# EAGLE design PATA Breakout (EAGLE 9.2.2)
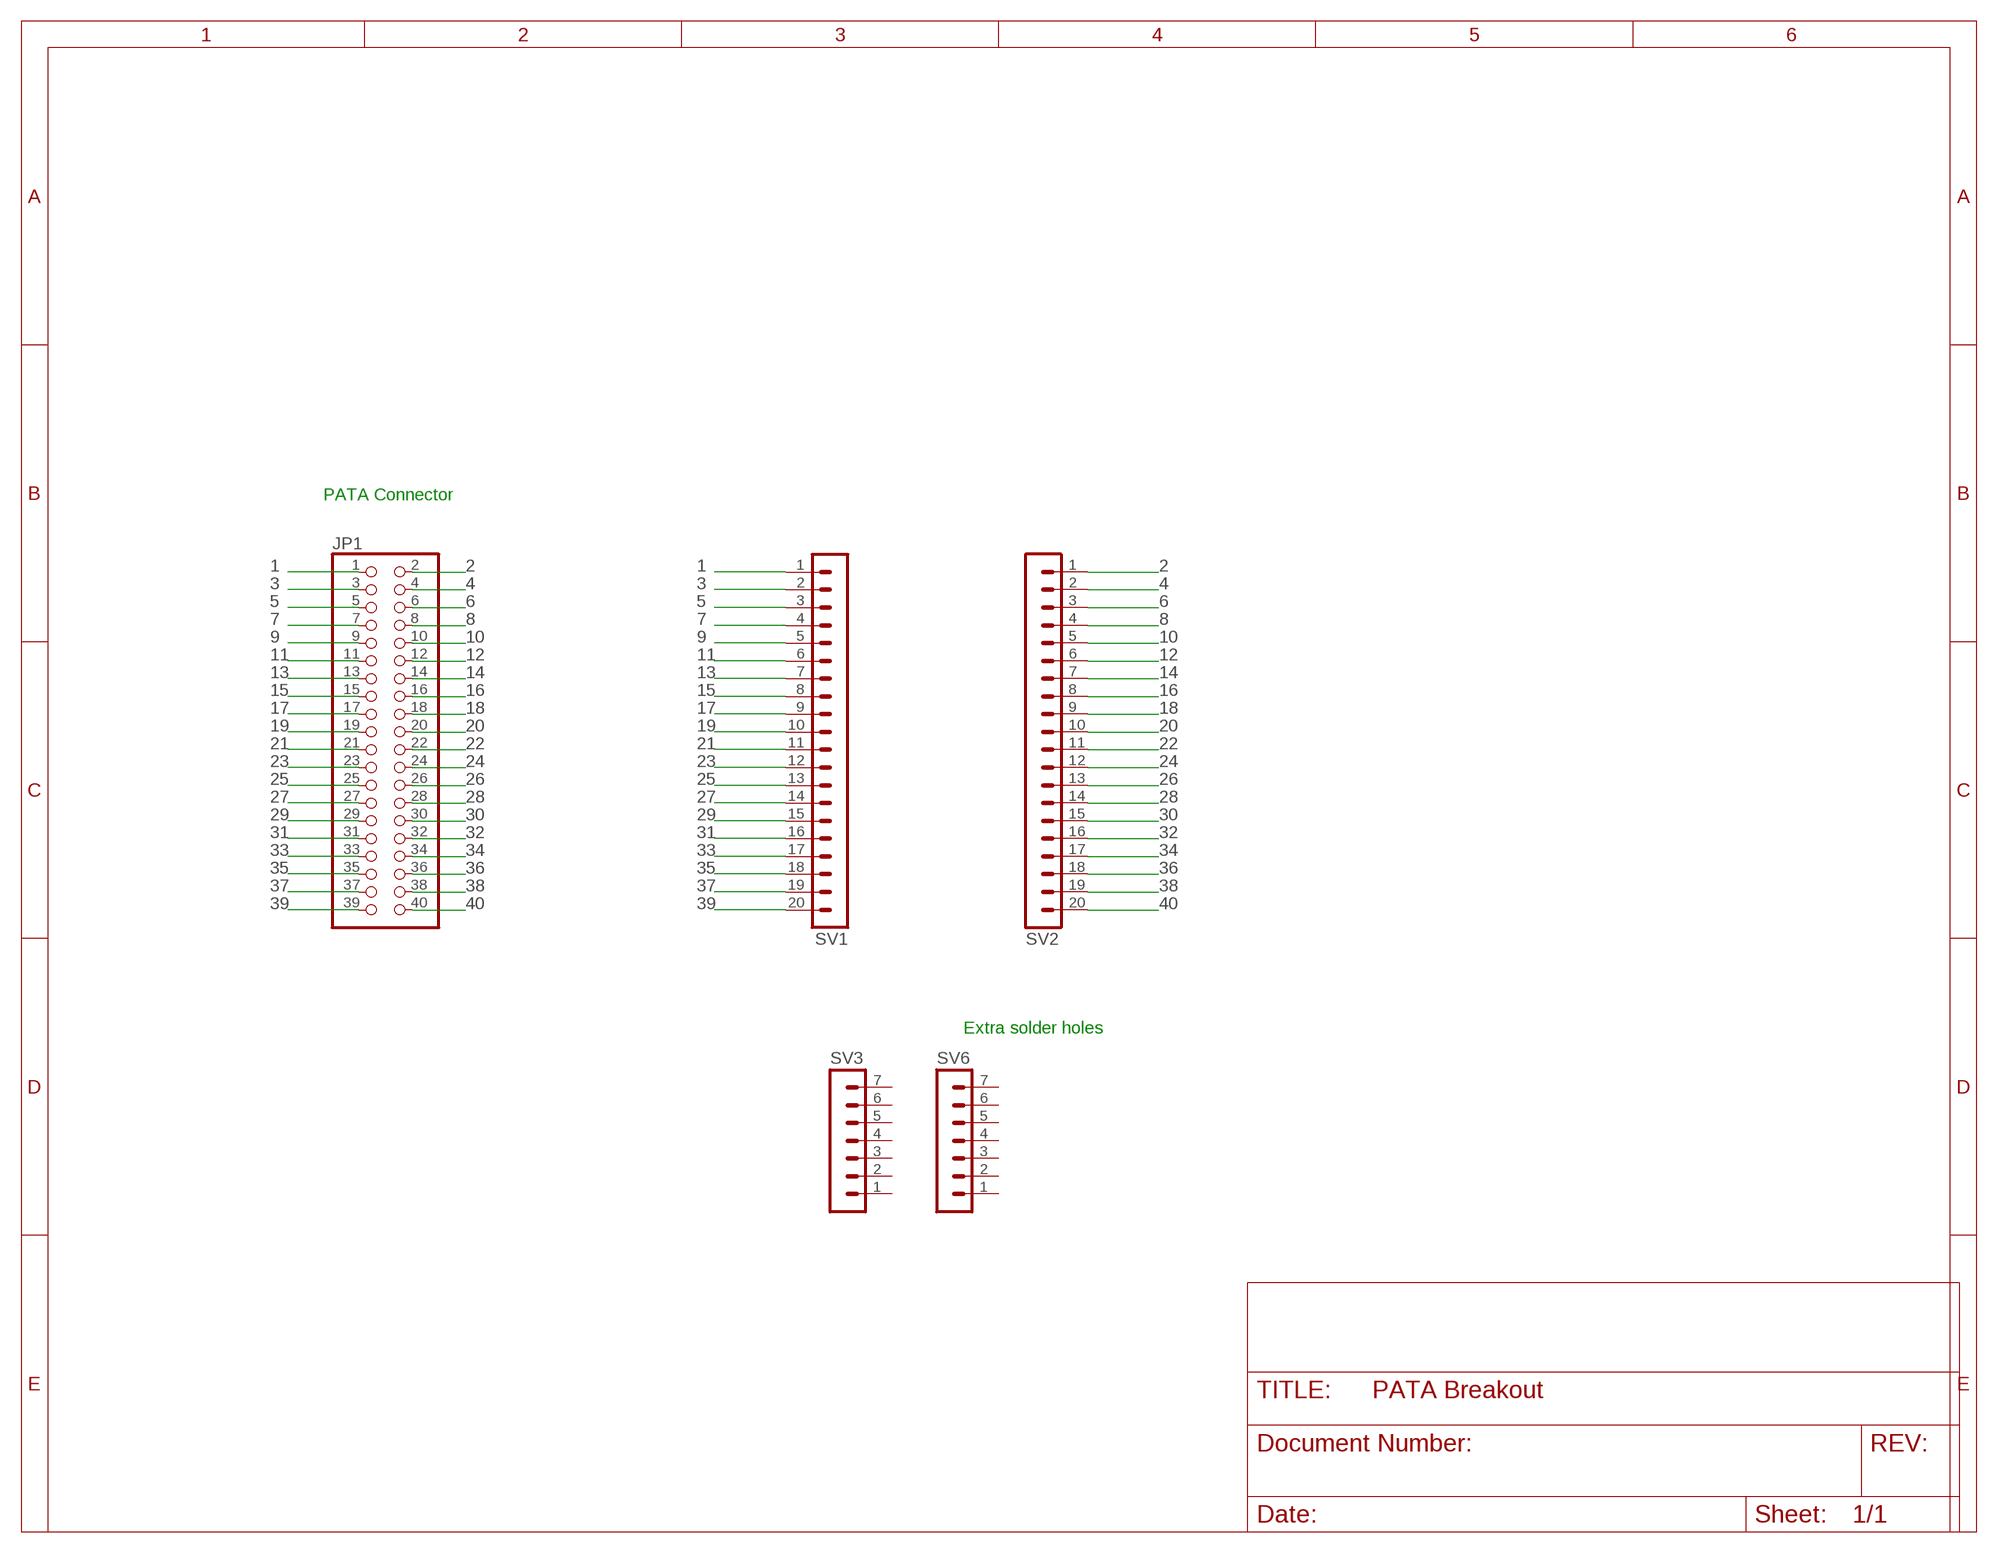
[diagram p0: schematic, sheet 1]

## Parts
JP1  PINHD-2X20  [2X20]
SV1  MA20-1L  [MA20-1L]
SV2  MA20-1L  [MA20-1L]
SV3  MA07-1  [MA07-1]
SV6  MA07-1  [MA07-1]

## Nets
1: JP1.1 SV1.1
2: JP1.2 SV2.1
3: JP1.3 SV1.2
4: JP1.4 SV2.2
5: JP1.5 SV1.3
6: JP1.6 SV2.3
7: JP1.7 SV1.4
8: JP1.8 SV2.4
9: JP1.9 SV1.5
10: JP1.10 SV2.5
11: JP1.11 SV1.6
12: JP1.12 SV2.6
13: JP1.13 SV1.7
14: JP1.14 SV2.7
15: JP1.15 SV1.8
16: JP1.16 SV2.8
17: JP1.17 SV1.9
18: JP1.18 SV2.9
19: JP1.19 SV1.10
20: JP1.20 SV2.10
21: JP1.21 SV1.11
22: JP1.22 SV2.11
23: JP1.23 SV1.12
24: JP1.24 SV2.12
25: JP1.25 SV1.13
26: JP1.26 SV2.13
27: JP1.27 SV1.14
28: JP1.28 SV2.14
29: JP1.29 SV1.15
30: JP1.30 SV2.15
31: JP1.31 SV1.16
32: JP1.32 SV2.16
33: JP1.33 SV1.17
34: JP1.34 SV2.17
35: JP1.35 SV1.18
36: JP1.36 SV2.18
37: JP1.37 SV1.19
38: JP1.38 SV2.19
39: JP1.39 SV1.20
40: JP1.40 SV2.20
Unconnected: SV3.1 SV3.2 SV3.3 SV3.4 SV3.5 SV3.6 SV3.7 SV6.1 SV6.2 SV6.3 SV6.4 SV6.5 SV6.6 SV6.7

## Notes on the sheet
- PATA Connector
- Extra solder holes

## Library data of the parts
JP1 = pinhead:PINHD-2X20: PIN HEADER
SV1 SV2 = con-lstb:MA20-1L: PIN HEADER; OC_FARNELL: unknown; OC_NEWARK: unknown
SV3 SV6 = con-lstb:MA07-1: PIN HEADER; OC_FARNELL: unknown; OC_NEWARK: unknown

## Board
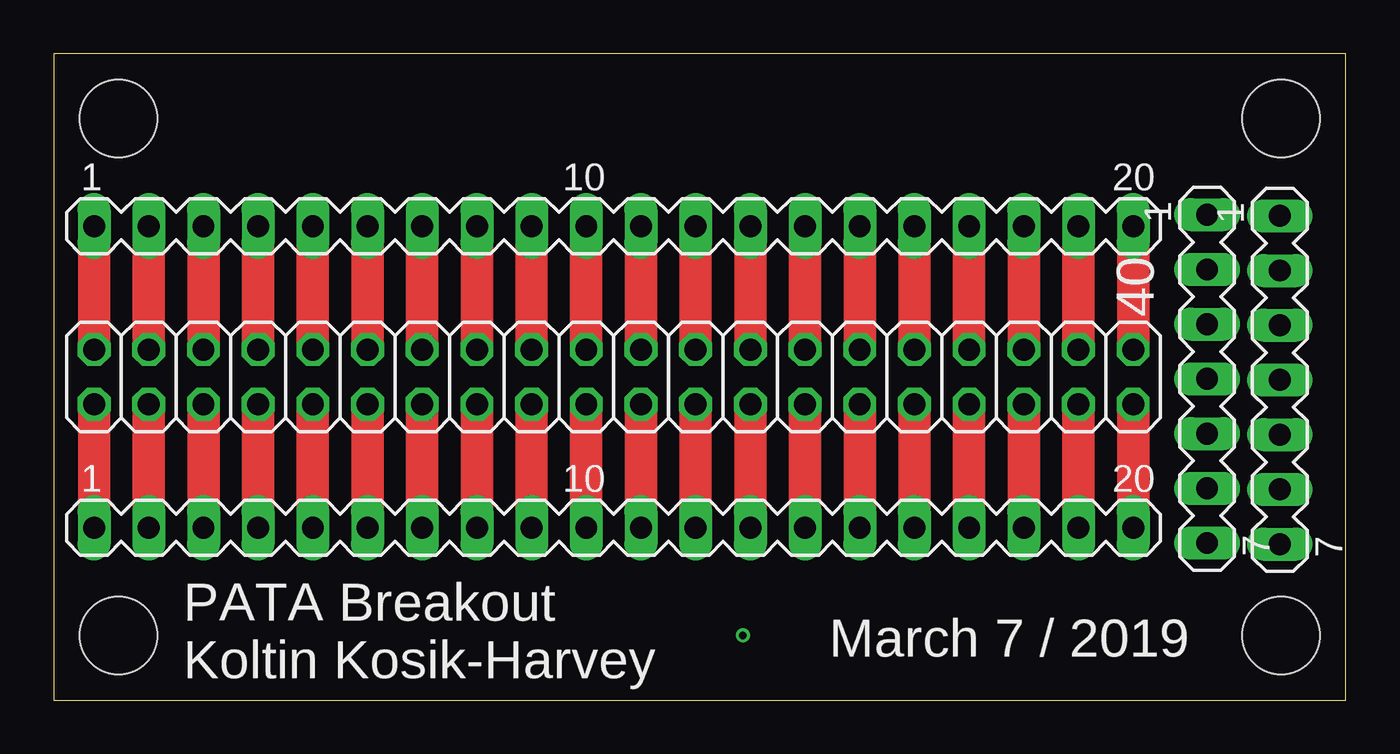
[diagram p1: board, top side]
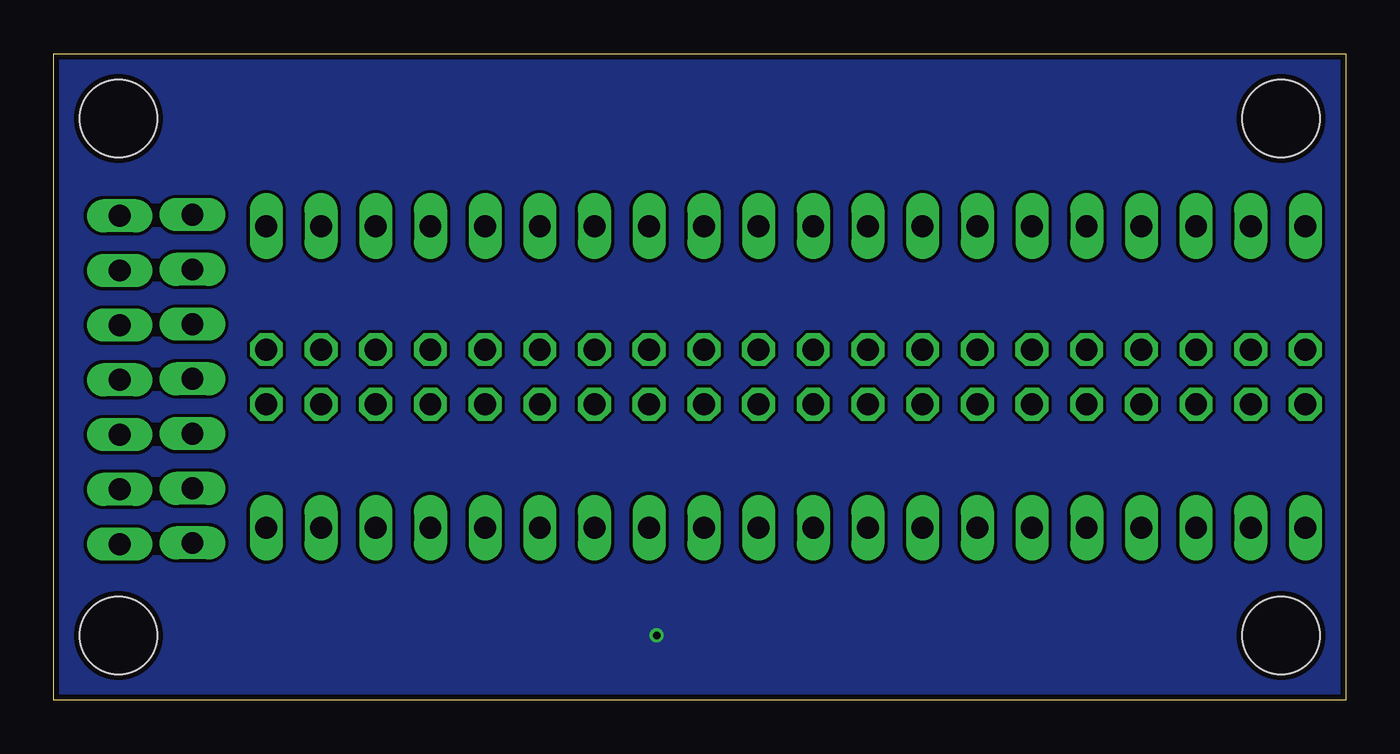
[diagram p2: board, bottom side, seen from below]

Size 60 x 30 mm. Coordinates in mm from the lower left corner, seen from the top.
Outline: 0,0 60,0 60,30 0,30 0,0
Copper layers (1*16): Top 0.035mm / dielectric 1.5mm / Bottom 0.035mm
Design rules "SeeedStudio_2layer_DRU_no_angle_20140221": minimum track width 6mil, minimum drill 12mil, track to track 6mil, track to pad 6mil, pad to pad 6mil, via to via 6mil, smd to smd 0mil, copper to edge 10mil, drill to drill 10mil, minimum pad ring 10mil, minimum via ring 6mil, stop-mask expansion 2mil, vias tented up to drill 100mil, thermal gap 10mil
Holes 3.6 mm at 3,3 57,3 3,27 57,27

### Footprints (pad centres in the part's own frame; a part is rotated, then mirrored left to right if it is on the bottom)
2X20 = drill 1.016 octagon: 1 -24.13,-1.27; 2 -24.13,1.27; 3 -21.59,-1.27; 4 -21.59,1.27; 5 -19.05,-1.27; 6 -19.05,1.27; 7 -16.51,-1.27; 8 -16.51,1.27; 9 -13.97,-1.27; 10 -13.97,1.27; 11 -11.43,-1.27; 12 -11.43,1.27; 13 -8.89,-1.27; 14 -8.89,1.27; 15 -6.35,-1.27; 16 -6.35,1.27; 17 -3.81,-1.27; 18 -3.81,1.27; 19 -1.27,-1.27; 20 -1.27,1.27; 21 1.27,-1.27; 22 1.27,1.27; 23 3.81,-1.27; 24 3.81,1.27; 25 6.35,-1.27; 26 6.35,1.27; 27 8.89,-1.27; 28 8.89,1.27; 29 11.43,-1.27; 30 11.43,1.27; 31 13.97,-1.27; 32 13.97,1.27; 33 16.51,-1.27; 34 16.51,1.27; 35 19.05,-1.27; 36 19.05,1.27; 37 21.59,-1.27; 38 21.59,1.27; 39 24.13,-1.27; 40 24.13,1.27
MA20-1L = drill 1.016 long: 1 24.13,0; 2 21.59,0; 3 19.05,0; 4 16.51,0; 5 13.97,0; 6 11.43,0; 7 8.89,0; 8 6.35,0; 9 3.81,0; 10 1.27,0; 11 -1.27,0; 12 -3.81,0; 13 -6.35,0; 14 -8.89,0; 15 -11.43,0; 16 -13.97,0; 17 -16.51,0; 18 -19.05,0; 19 -21.59,0; 20 -24.13,0
MA07-1 = drill 1.016 long: 1 -7.62,0; 2 -5.08,0; 3 -2.54,0; 4 0,0; 5 2.54,0; 6 5.08,0; 7 7.62,0

### Placement (x,y rotation side)
JP1  26,15 0 top
SV1  26,8 180 top
SV2  26,22 180 top
SV3  56.94,14.86 270 top
SV6  53.56,14.91 270 top

### Tracks (layer width: path | path; a pad name or v marks a point on that pad's centre or on a via)
1
  Top 1.5: SV1.1 JP1.1
2
  Top 1.5: SV2.1 JP1.2
3
  Top 1.5: SV1.2 JP1.3
4
  Top 1.5: SV2.2 JP1.4
5
  Top 1.5: JP1.5 SV1.3
6
  Top 1.5: SV2.3 JP1.6
7
  Top 1.5: SV1.4 JP1.7
8
  Top 1.5: SV2.4 JP1.8
9
  Top 1.5: JP1.9 SV1.5
10
  Top 1.5: SV2.5 JP1.10
11
  Top 1.5: JP1.11 SV1.6
12
  Top 1.5: SV2.6 JP1.12
13
  Top 1.5: JP1.13 SV1.7
14
  Top 1.5: SV2.7 JP1.14
15
  Top 1.5: JP1.15 SV1.8
16
  Top 1.5: SV2.8 JP1.16
17
  Top 1.5: JP1.17 SV1.9
18
  Top 1.5: SV2.9 JP1.18
19
  Top 1.5: JP1.19 SV1.10
20
  Top 1.5: SV2.10 JP1.20
21
  Top 1.5: JP1.21 SV1.11
22
  Top 1.5: SV2.11 JP1.22
23
  Top 1.5: JP1.23 SV1.12
24
  Top 1.5: SV2.12 JP1.24
25
  Top 1.5: JP1.25 SV1.13
26
  Top 1.5: SV2.13 JP1.26
27
  Top 1.5: JP1.27 SV1.14
28
  Top 1.5: SV2.14 JP1.28
29
  Top 1.5: JP1.29 SV1.15
30
  Top 1.5: SV2.15 JP1.30
31
  Top 1.5: JP1.31 SV1.16
32
  Top 1.5: SV2.16 JP1.32
33
  Top 1.5: JP1.33 SV1.17
34
  Top 1.5: SV2.17 JP1.34
35
  Top 1.5: JP1.35 SV1.18
36
  Top 1.5: SV2.18 JP1.36
37
  Top 1.5: JP1.37 SV1.19
38
  Top 1.5: SV2.19 JP1.38
39
  Top 1.5: JP1.39 SV1.20
40
  Top 1.5: SV2.20 JP1.40
SHIELD  (via drill 0.35)
  other vias: 32,3
  pour Bottom (no thermals): 62,32 62,32 62,-2 -2,-2 -2,32

### Text on the board
tPlace: 40 | March 7 / 2019 | PATA Breakout / Koltin Kosik-Harvey